# EAGLE schematic lightampSMT (EAGLE 9.6.2)
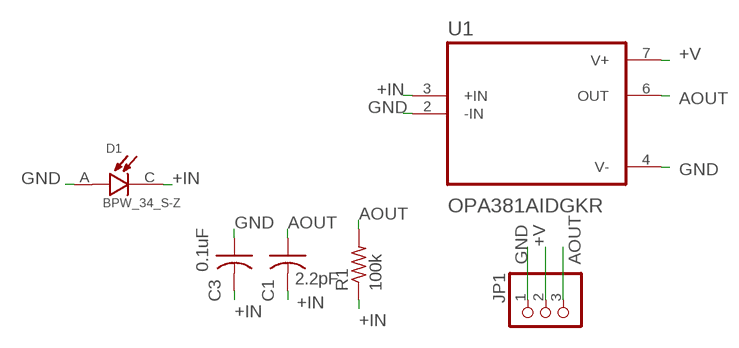
[diagram p0: schematic, sheet 1]

## Parts
C1  2.2pF  C-USC0603K  [C0603K]
C3  0.1uF  C-USC0603K  [C0603K]
D1  BPW_34_S-Z  [DIO_BPW_34_S-Z]
JP1  PINHD-1X3  [1X03]
R1  100k  R-US_R0603  [R0603]
U1  OPA381AIDGKR  [SOP65P490X110-8N]

## Nets
+IN: C1.2 C3.2 D1.C R1.1 U1.3(+IN)
+V: JP1.2 U1.7(V+)
AOUT: C1.1 JP1.3 R1.2 U1.6(OUT)
GND: C3.1 D1.A JP1.1 U1.2(-IN) U1.4(V-)

## Library data of the parts
C1 C3 = adafruit:C-US: CAPACITOR, American symbol
D1 = BPW_34_S-Z:BPW_34_S-Z: Silicon PIN Photodiode Check availability <https://pricing.snapeda.com/parts/BPW%2034%20S-Z/OSRAM%20Opto/view-part?ref=eda>; AVAILABILITY: In Stock; DESCRIPTION: Photodiode 850nm 20ns 120° 2-SMD, Gull Wing; MF: OSRAM Opto; MP: BPW 34 S-Z; PACKAGE: SMD-2 OSRAM Opto Semiconductors; PRICE: None; PURCHASE-URL: https://pricing.snapeda.com/search/part/BPW 34 S-Z/?ref=eda
JP1 = adafruit:PINHD-1X3: PIN HEADER
R1 = adafruit:R-US_: RESISTOR, American symbol
U1 = OPA381AIDGKR:OPA381AIDGKR: Check availability <https://pricing.snapeda.com/parts/OPA381AIDGKR/Texas%20Instruments/view-part?ref=eda>; AVAILABILITY: In Stock; DESCRIPTION: Precision, Low Power, High-Speed Transimpedance Amplifier 8-VSSOP -40 to 125; MF: Texas Instruments; MP: OPA381AIDGKR; PACKAGE: VSSOP-8 Texas Instruments; PRICE: None; PURCHASE-URL: https://pricing.snapeda.com/search/part/OPA381AIDGKR/?ref=eda